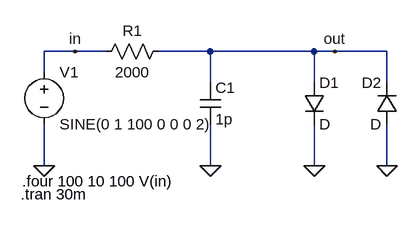
[diagram p0: schematic clipper.asc]
clipper.asc, the LTspice schematic file:
Version 4
SHEET 1 880 680
WIRE -128 80 -176 80
WIRE -80 80 -128 80
WIRE 80 80 0 80
WIRE 240 80 80 80
WIRE 272 80 240 80
WIRE 352 80 272 80
WIRE -176 112 -176 80
WIRE 80 128 80 80
WIRE 240 128 240 80
WIRE 352 128 352 80
WIRE -176 256 -176 192
WIRE 80 256 80 192
WIRE 240 256 240 192
WIRE 352 256 352 192
FLAG 80 256 0
FLAG 240 256 0
FLAG 352 256 0
FLAG -176 256 0
FLAG 272 80 out
FLAG -128 80 in
SYMBOL diode 224 128 R0
SYMATTR InstName D1
SYMBOL diode 368 192 R180
WINDOW 0 24 64 Left 2
WINDOW 3 24 0 Left 2
SYMATTR InstName D2
SYMBOL cap 64 128 R0
SYMATTR InstName C1
SYMATTR Value 1p
SYMBOL res 16 64 R90
WINDOW 0 0 56 VBottom 2
WINDOW 3 32 56 VTop 2
SYMATTR InstName R1
SYMATTR Value 2000
SYMBOL voltage -176 96 R0
WINDOW 123 0 0 Left 0
WINDOW 39 0 0 Left 0
SYMATTR InstName V1
SYMATTR Value SINE(0 1 100 0 0 0 2)
TEXT -210 280 Left 2 !.four 100 10 100 V(in)
TEXT -212 300 Left 2 !.tran 30m

The netlist it stands for:
* clipper.asc
D1 out 0 D
D2 0 out D
C1 out 0 1p
R1 out in 2000
V1 in 0 SINE(0 1 100 0 0 0 2)
.model D D
.lib standard.dio
.four 100 10 100 V(in)
.tran 30m
.backanno
.end